# Altium schematic sheet PWR_SRC.SchDoc
size A3
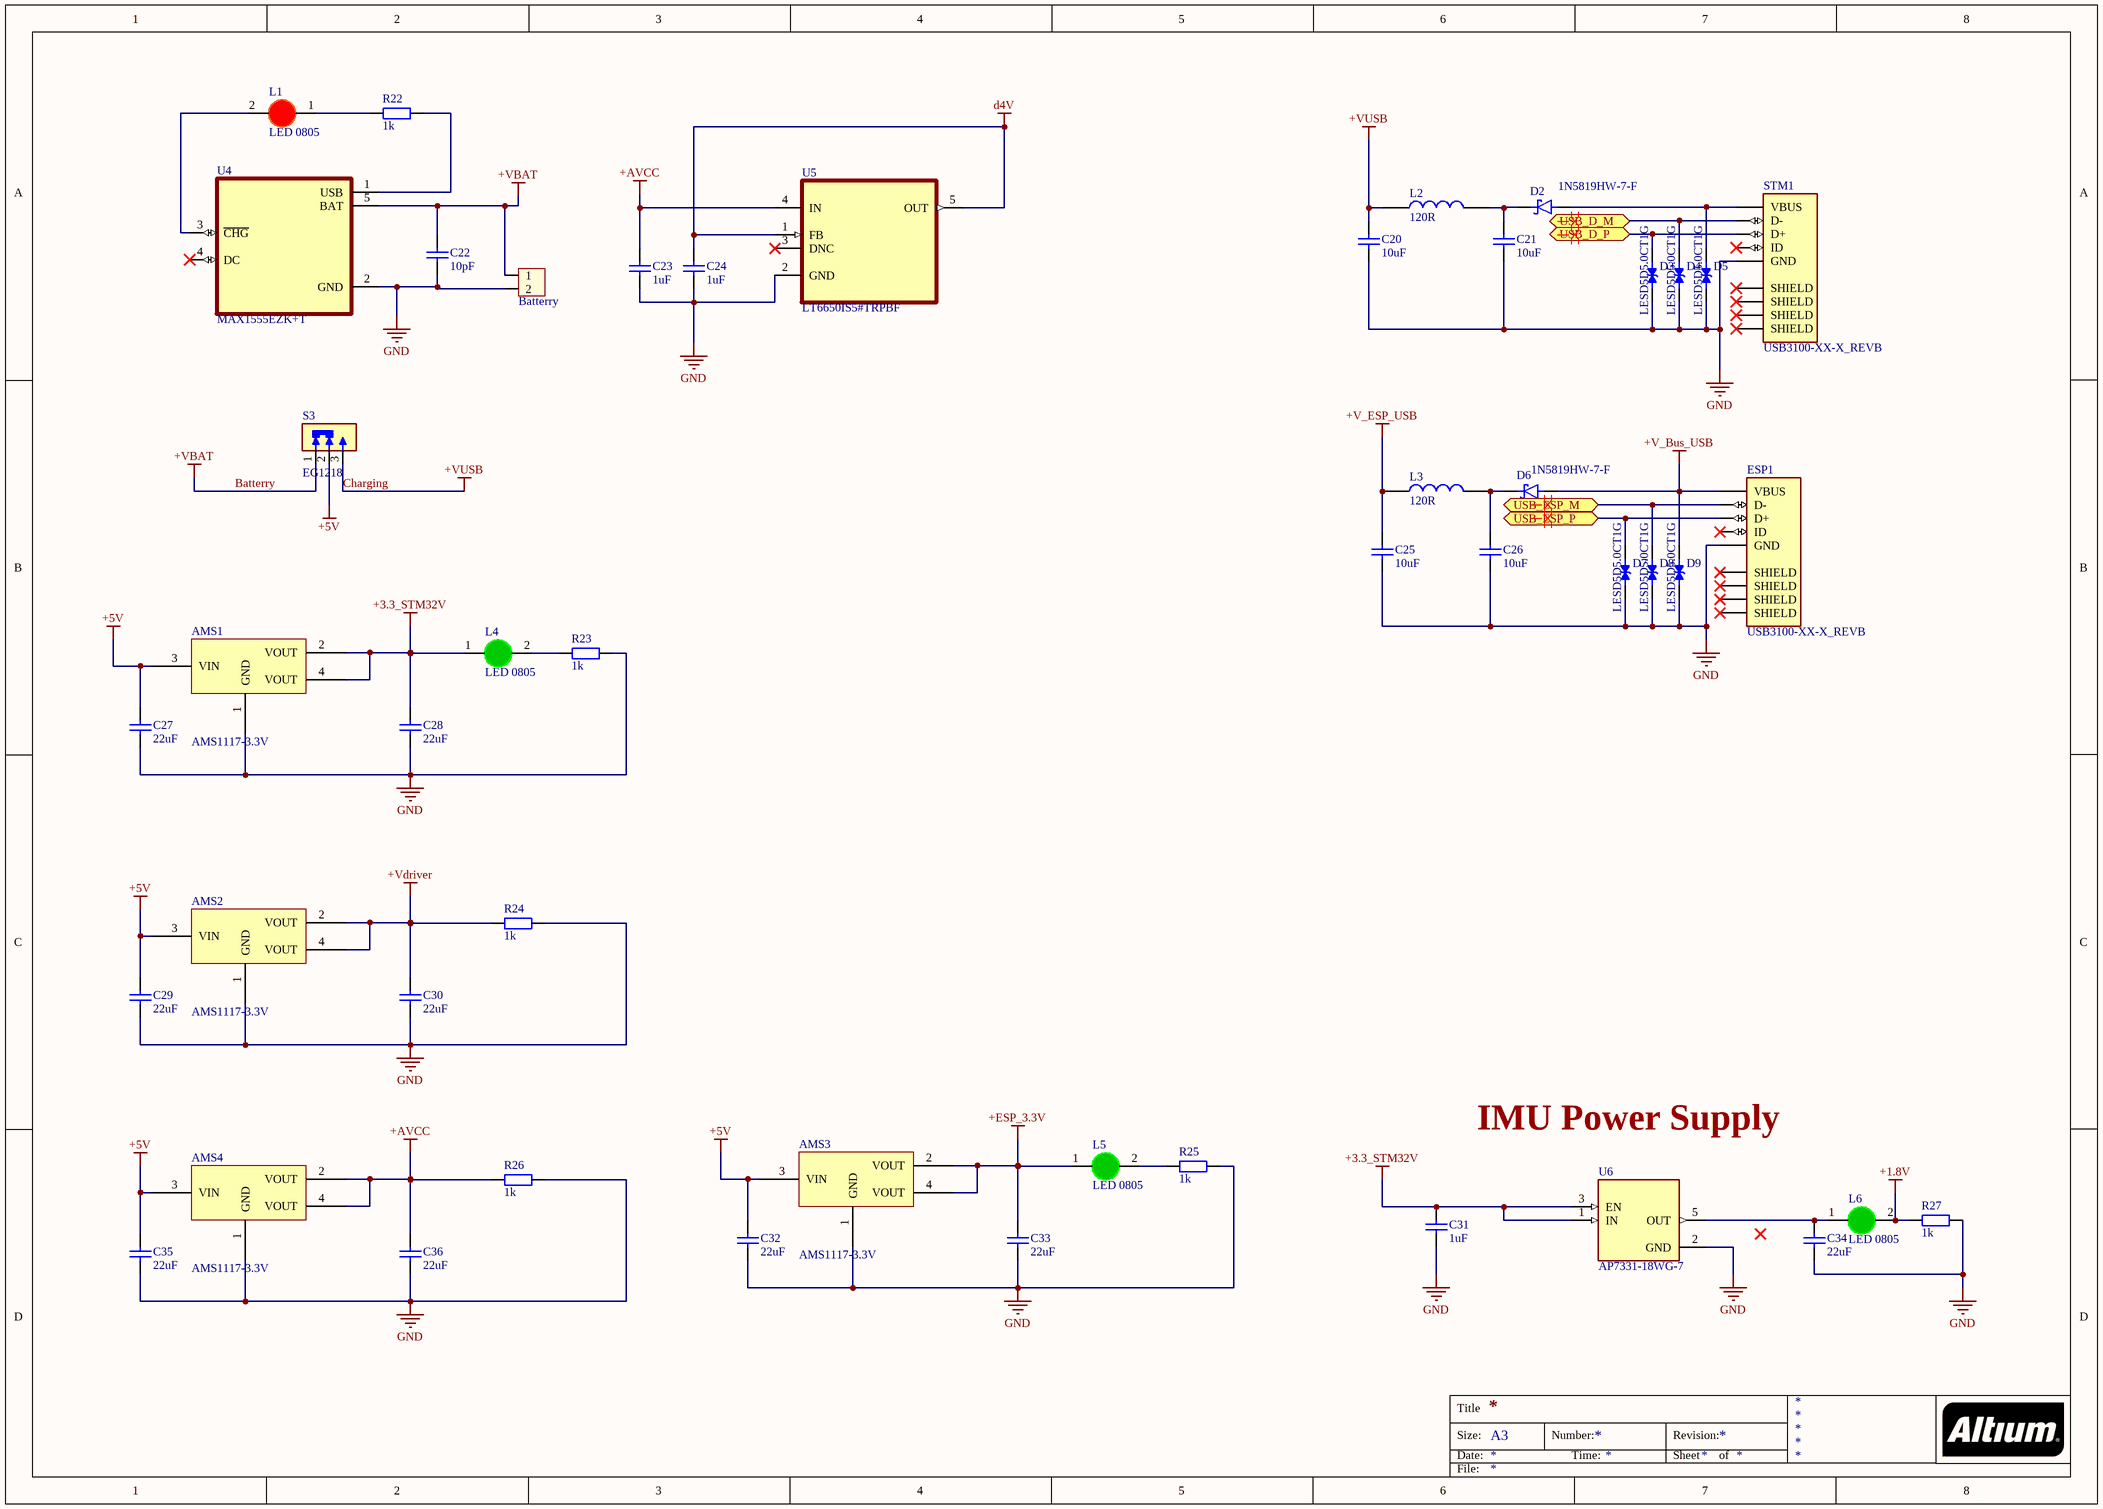
[diagram p0: PWR_SRC.SchDoc]

## Parts
AMS1  AMS1117-3.3V  [SOT223]
AMS2  AMS1117-3.3V  [SOT223]
AMS3  AMS1117-3.3V  [SOT223]
AMS4  AMS1117-3.3V  [SOT223]
Batterry1  Batterry  [XH2.54M-2]
C20  10uF  [tu 0805]
C21  10uF  [tu 0805]
C22  10pF  [tu 0805]
C23  1uF  [tu 0603]
C24  1uF  [tu 0603]
C25  10uF  [tu 0805]
C26  10uF  [tu 0805]
C27  22uF  [tu 0805]
C28  22uF  [tu 0805]
C29  22uF  [tu 0805]
C30  22uF  [tu 0805]
C31  1uF  [tu 0805]
C32  22uF  [tu 0805]
C33  22uF  [tu 0805]
C34  22uF  [tu 0805]
C35  22uF  [tu 0805]
C36  22uF  [tu 0805]
D2  1N5819HW-7-F  [SOD3715X145N]
D3  LESD5D5.0CT1G  [TVS_LESD5D5.0CT1G]
D4  LESD5D5.0CT1G  [TVS_LESD5D5.0CT1G]
D5  LESD5D5.0CT1G  [TVS_LESD5D5.0CT1G]
D6  1N5819HW-7-F  [SOD3715X145N]
D7  LESD5D5.0CT1G  [TVS_LESD5D5.0CT1G]
D8  LESD5D5.0CT1G  [TVS_LESD5D5.0CT1G]
D9  LESD5D5.0CT1G  [TVS_LESD5D5.0CT1G]
ESP1  USB3100-XX-X_REVB  [GCT_USB3100-XX-X_REVB]
L1  LED 0805  [LED-1206-Red]
L2  120R  [IND-0603 (1608)]
L3  120R  [IND-0603 (1608)]
L4  LED 0805  [LED-1206-Green]
L5  LED 0805  [LED-1206-Green]
L6  LED 0805  [LED-1206-Green]
R22  1k  [tro smd 0805]
R23  1k  [tro smd 0805]
R24  1k  [tro smd 0805]
R25  1k  [tro smd 0805]
R26  1k  [tro smd 0805]
R27  1k  [tro smd 0805]
S3  EG1218  [SW_EG1218]
STM1  USB3100-XX-X_REVB  [GCT_USB3100-XX-X_REVB]
U4  MAX1555EZK+T  [SOT95P275X110-5N]
U5  LT6650IS5#TRPBF  [SOT95P280X100-5N]
U6  AP7331-18WG-7  [SOT95P285X145-5N]

## Ports
USB_D_M (bidir), USB_D_P (bidir), USB_ESP_M (bidir), USB_ESP_P (bidir)

## Nets
+1.8V: L6.2(K) R27.1
+3.3_STM32V: AMS1.2(VOUT) AMS1.4(VOUT) C28.1 C31.1 L4.1(A) U6.1(IN) U6.3(EN)
+5V: AMS1.3(VIN) AMS2.3(VIN) AMS3.3(VIN) AMS4.3(VIN) C27.1 C29.1 C32.1 C35.1 S3.2(COM)
+AVCC: AMS4.2(VOUT) AMS4.4(VOUT) C23.1 C36.1 R26.1 U5.4(IN)
+ESP_3.3V: AMS3.2(VOUT) AMS3.4(VOUT) C33.1 L5.1(A)
+V_Bus_USB: D6.A D9.2 ESP1.1(VBUS)
+V_ESP_USB: C25.1 L3.1
+Vdriver: AMS2.2(VOUT) AMS2.4(VOUT) C30.1 R24.1
Batterry: Batterry1.1 C22.1 S3.1(NC) U4.5(BAT)  [also labelled +VBAT]
Charging: C20.1 L2.1 S3.3(NO)  [also labelled +VUSB]
d4V: C24.1 U5.1(FB) U5.5(OUT)
GND: AMS1.1(GND) AMS2.1(GND) AMS3.1(GND) AMS4.1(GND) Batterry1.2 C20.2 C21.2 C22.2 C23.2 C24.2 C25.2 C26.2 C27.2 C28.2 C29.2 C30.2 C31.2 C32.2 C33.2 C34.2 C35.2 C36.2 D3.1 D4.1 D5.1 D7.1 D8.1 D9.1 ESP1.5(GND) R23.2 R24.2 R25.2 R26.2 R27.2 STM1.5(GND) U4.2(GND) U5.2(GND) U6.2(GND)
USB_D_M: D4.2 STM1.2(D-) ; port USB_D_M
USB_D_P: D3.2 STM1.3(D+) ; port USB_D_P
USB_ESP_M: D8.2 ESP1.2(D-) ; port USB_ESP_M
USB_ESP_P: D7.2 ESP1.3(D+) ; port USB_ESP_P
NetC21_1: C21.1 D2.C(K) L2.2
NetC26_1: C26.1 D6.C(K) L3.2
NetC34_1: C34.1 L6.1(A) U6.5(OUT)
NetD2_A: D2.A D5.2 STM1.1(VBUS)
NetL1_1: L1.1(A) R22.1
NetL1_2: L1.2(K) U4.3(~{CHG})
NetL4_2: L4.2(K) R23.1
NetL5_2: L5.2(K) R25.1
NetR22_2: R22.2 U4.1(USB)

Not connected (* = marked no-connect by the designer): ESP1 4(ID)* 6(SHIELD)* 7(SHIELD)* 8(SHIELD)* 9(SHIELD)*; STM1 4(ID)* 6(SHIELD)* 7(SHIELD)* 8(SHIELD)* 9(SHIELD)*; U4 4(DC)*; U5 3(DNC)*

## Layout directives
differential pair: (no net found under the mark)

## Notes on the sheet
- IMU Power Supply
- Title
- Size:
- Date:
- A3
- Number:
- Time:
- Revision:
- Sheet
- of
- File:

## Library data of the parts
AMS1-AMS4 = AMS1117 SMD: Dán; Value: AMS1117-3.3V SOT223; Don_Vi: Con; Ma_Hang: MH000596; Ghi_Chu: *; Kieu_Chan: *; Chung_Loai: Dán
Batterry1 = Header 2P 2.54 Duc Thang: Cắm; Ten_Linh_Kien: Header 2P XH2.54-2P Đực Thẳng; Don_Vi: Con; Ma_Hang: MH001283; Chung_Loai: Cắm
C20-C22 C25-C30 C32-C36 = Tu 0805 10pF 50V 10%: Dán; Don_Vi: Con; So_Chan: 2; Ten_Linh_Kien: Tụ 0805 10P 10% 50V; Ma_Hang: MH004554; Chung_Loai: Dán; Kieu_Chan: *
C23 C24 = Tu 0603 470pF 50V 10%: Dán; Don_Vi: Con; So_Chan: 2; Ten_Linh_Kien: Tụ 0603 470P 50V 10%; Ma_Hang: MH004571; Chung_Loai: Dán; Kieu_Chan: *
C31 = Tu 0805 106 16V 10%: Dán; Ten_Linh_Kien: Tụ 0805 106-10uF 10% 16V; So_Chan: 2; Don_Vi: Con; Ma_Hang: MH004553; Chung_Loai: Dán; Kieu_Chan: *
D2 D6 = 1N5819HW-7-F: 1N5819HW Series 40 V 1 A Surface Mount Schottky Barrier Rectifier - SOD-123; MF: {'manufacturer': u'Diodes Inc.'}; Package: None; Price: None; Value: *; MP: 1N5819HW-7-F; Availability: Unavailable
D3-D5 D7-D9 = LESD5D5.0CT1G: MF: {'manufacturer': u'Leshan Radio Co.'}; Package: None; Price: None; Value: *; MP: LESD5D5.0CT1G; Availability: Unavailable
ESP1 STM1 = USB3100-XX-X_REVB: Micro USB Receptacle, Type B, Surface Mount, Horizontal, Top (Reverse) Mount, without Peg; MF: {'manufacturer': u'Global Connector Technology'}; Package: None; Price: None; Value: *; MP: USB3100-XX-X_REVB; Availability: Unavailable
L1 = LED 1206 Do: Dán; Don_Vi: Con; Ma_Hang: MH002334; Ten_Linh_Kien: LED1206 Màu Đỏ (Red); Ghi_Chu: *; Kieu_Chan: *; Chung_Loai: Dán
L2 L3 = FBMJ1608HM230NT: IND-FERRITE BEAD 23 OHM  4A 0603 1LN; CompanyID: VT-01060; Solder: SMT; Value: 23R/4A; MPN: FBMJ1608HM230NT; Category: FERRITE BEAD; PinCount: 2
L4-L6 = LED 1206 Xanh La: Dán; Don_Vi: Con; Ma_Hang: MH002947; Ten_Linh_Kien: LED1206 Màu Xanh Lá (Green); Ghi_Chu: *; Kieu_Chan: *; Chung_Loai: Dán
R22-R27 = Tro 0805 1% 1k: Dán; Don_Vi: Con; So_Chan: 2; Ten_Linh_Kien: Trở 0805 1% 1k; Ma_Hang: MH005468; Chung_Loai: Dán; Kieu_Chan: *
S3 = EG1218: Slide Switch, EG Series, SPDT, Non-Shorting, ON-ON, 200mA DC, 30VDC, PC Pin | E-Switch EG1218; SnapEDA_Link: https://www.snapeda.com/parts/EG1218/E-Switch/view-part/?ref=snap; Package: None; Value: *; MF: E-Switch; MP: EG1218; Check_prices: https://www.snapeda.com/parts/EG1218/E-Switch/view-part/?ref=eda
U4 = MAX1555EZK+T: MF: {'manufacturer': u'Analog Devices'}; Package: None; Price: None; Value: *; MP: MAX1555EZK+; Availability: Unavailable
U5 = LT6650IS5#TRPBF: Micropower, 400mV Reference with Rail-to-Rail Buffer Amplifier; MF: {'manufacturer': u'Analog Devices'}; Package: None; Price: None; Value: *; MP: LT6650IS5#TRPBF; Availability: Unavailable
U6 = AP7331-18WG-7: LDO Regulator Pos 1.8V 0.3A 5-Pin SOT-25 T/R; MF: {'manufacturer': u'Diodes Inc.'}; Package: None; Price: None; Value: *; MP: AP7331-18WG-7; Availability: Unavailable